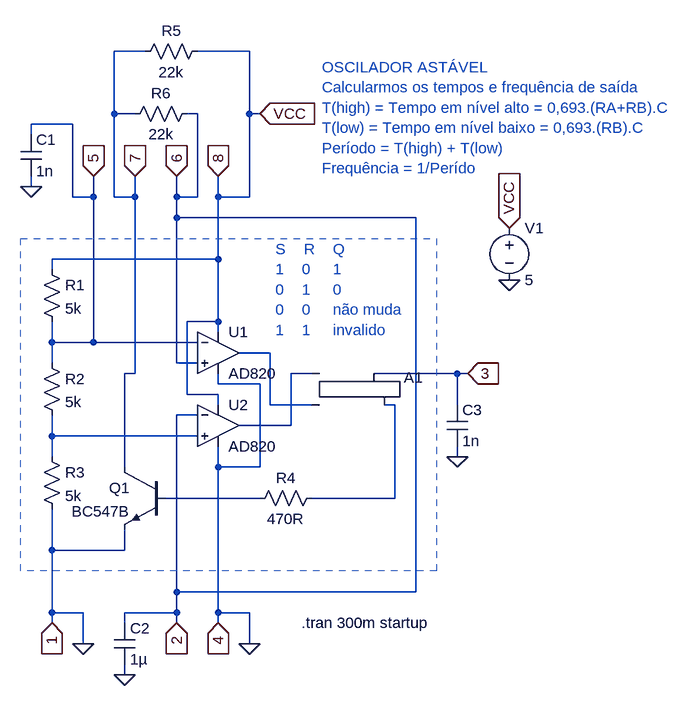
[diagram p0: schematic CI_555.asc]
CI_555.asc, the LTspice schematic file:
Version 4
SHEET 1 1380 708
WIRE 176 -272 128 -272
WIRE 336 -272 256 -272
WIRE 128 -176 128 -272
WIRE 160 -176 128 -176
WIRE 256 -176 240 -176
WIRE 336 -176 336 -272
WIRE 352 -176 336 -176
WIRE 64 -160 0 -160
WIRE 0 -144 0 -160
WIRE 0 -64 0 -80
WIRE 64 -48 64 -160
WIRE 96 -48 96 -80
WIRE 96 -48 64 -48
WIRE 128 -48 128 -176
WIRE 160 -48 160 -80
WIRE 160 -48 128 -48
WIRE 224 -48 224 -80
WIRE 256 -48 256 -176
WIRE 256 -48 224 -48
WIRE 288 -48 288 -80
WIRE 336 -48 336 -176
WIRE 336 -48 288 -48
WIRE 224 -16 224 -48
WIRE 592 -16 224 -16
WIRE 288 48 288 -48
WIRE 288 48 32 48
WIRE 32 64 32 48
WIRE 288 144 288 48
WIRE 288 144 240 144
WIRE 288 160 288 144
WIRE 32 176 32 144
WIRE 96 176 96 -48
WIRE 96 176 32 176
WIRE 256 176 96 176
WIRE 368 192 320 192
WIRE 32 208 32 176
WIRE 224 208 224 -16
WIRE 256 208 224 208
WIRE 160 224 160 -48
WIRE 160 224 144 224
WIRE 432 224 400 224
WIRE 656 224 528 224
WIRE 672 224 656 224
WIRE 288 240 288 224
WIRE 352 240 288 240
WIRE 240 256 240 144
WIRE 288 256 240 256
WIRE 288 272 288 256
WIRE 368 272 368 192
WIRE 432 272 368 272
WIRE 560 272 544 272
WIRE 656 272 656 224
WIRE 256 288 224 288
WIRE 400 304 400 224
WIRE 400 304 320 304
WIRE 32 320 32 288
WIRE 256 320 32 320
WIRE 32 352 32 320
WIRE 656 352 656 336
WIRE 144 368 144 224
WIRE 288 368 288 336
WIRE 352 368 352 240
WIRE 352 368 288 368
WIRE 352 416 208 416
WIRE 560 416 560 272
WIRE 560 416 432 416
WIRE 32 496 32 432
WIRE 144 496 144 464
WIRE 144 496 32 496
WIRE 224 560 224 288
WIRE 592 560 592 -16
WIRE 592 560 224 560
WIRE 32 592 32 496
WIRE 80 592 32 592
WIRE 224 592 224 560
WIRE 224 592 144 592
WIRE 288 592 288 368
WIRE 336 592 288 592
WIRE 32 608 32 592
WIRE 144 608 144 592
WIRE 224 608 224 592
WIRE 288 608 288 592
WIRE 80 640 80 592
WIRE 336 640 336 592
WIRE 144 688 144 672
FLAG 288 -80 8
IOPIN 288 -80 In
FLAG 288 608 4
IOPIN 288 608 In
FLAG 224 608 2
IOPIN 224 608 In
FLAG 32 608 1
IOPIN 32 608 In
FLAG 96 -80 5
IOPIN 96 -80 In
FLAG 160 -80 7
IOPIN 160 -80 In
FLAG 224 -80 6
IOPIN 224 -80 In
FLAG 672 224 3
IOPIN 672 224 In
FLAG 736 80 0
FLAG 736 0 VCC
IOPIN 736 0 In
FLAG 0 -64 0
FLAG 144 688 0
FLAG 80 640 0
FLAG 336 640 0
FLAG 352 -176 VCC
IOPIN 352 -176 In
FLAG 656 352 0
SYMBOL res 16 48 R0
SYMATTR InstName R1
SYMATTR Value 5k
SYMBOL res 16 192 R0
SYMATTR InstName R2
SYMATTR Value 5k
SYMBOL res 16 336 R0
SYMATTR InstName R3
SYMATTR Value 5k
SYMBOL EXTRA\\AudioOpamp\\AD\\AD820 288 192 R0
SYMATTR InstName U1
SYMBOL EXTRA\\AudioOpamp\\AD\\AD820 288 304 R0
SYMATTR InstName U2
SYMBOL npn 208 368 M0
SYMATTR InstName Q1
SYMATTR Value BC547B
SYMBOL Digital\\srflop 480 176 R0
SYMATTR InstName A1
SYMATTR SpiceLine Vhigh=5
SYMBOL res 448 400 R90
WINDOW 0 0 56 VBottom 2
WINDOW 3 32 56 VTop 2
SYMATTR InstName R4
SYMATTR Value 470R
SYMBOL voltage 736 -16 R0
SYMATTR InstName V1
SYMATTR Value 5
SYMBOL res 272 -288 R90
WINDOW 0 0 56 VBottom 2
WINDOW 3 32 56 VTop 2
SYMATTR InstName R5
SYMATTR Value 22k
SYMBOL res 256 -192 R90
WINDOW 0 0 56 VBottom 2
WINDOW 3 32 56 VTop 2
SYMATTR InstName R6
SYMATTR Value 22k
SYMBOL cap -16 -144 R0
SYMATTR InstName C1
SYMATTR Value 1n
SYMBOL cap 128 608 R0
SYMATTR InstName C2
SYMATTR Value 1µ
SYMBOL cap 640 272 R0
SYMATTR InstName C3
SYMATTR Value 1n
TEXT 416 608 Left 2 !.tran 300m startup
TEXT 448 -248 Left 2 ;OSCILADOR ASTÁVEL\nCalcularmos os tempos e frequência de saída\nT(high) = Tempo em nível alto = 0,693.(RA+RB).C\nT(low) = Tempo em nível baixo = 0,693.(RB).C\nPeríodo = T(high) + T(low)\nFrequência = 1/Perído
TEXT 376 32 Left 2 ;S    R    Q\n1    0     1\n0    1     0\n0    0     não muda\n1    1     invalido
RECTANGLE Normal 624 528 -16 16 2

The netlist it stands for:
* CI_555.asc
R1 VCC 5 5k
R2 5 N004 5k
R3 N004 0 5k
* U1: AD820 (symbol EXTRA\AudioOpamp\AD\AD820 not available, pins judged from their places): In+=6 In-=5 V+=VCC V-=0 OUT=N001
* U2: AD820 (symbol EXTRA\AudioOpamp\AD\AD820 not available, pins judged from their places): In+=N004 In-=6 V+=VCC V-=0 OUT=N002
Q1 7 N005 0 0 BC547B
A1 N002 N001 0 0 0 N003 3 0 SRFLOP Vhigh=5
R4 N003 N005 470R
V1 VCC 0 5
R5 VCC 7 22k
R6 6 7 22k
C1 5 0 1n
C2 6 0 1µ
C3 3 0 1n
.model NPN NPN
.model PNP PNP
.lib standard.bjt
.tran 300m startup
* OSCILADOR ASTÁVEL
* Calcularmos os tempos e frequência de saída
* T(high) = Tempo em nível alto = 0,693.(RA+RB).C
* T(low) = Tempo em nível baixo = 0,693.(RB).C
* Período = T(high) + T(low)
* Frequência = 1/Perído
* S    R    Q
* 1    0     1
* 0    1     0
* 0    0     não muda
* 1    1     invalido
.backanno
.end